# Altium schematic sheet Sheet.SchDoc
size A4
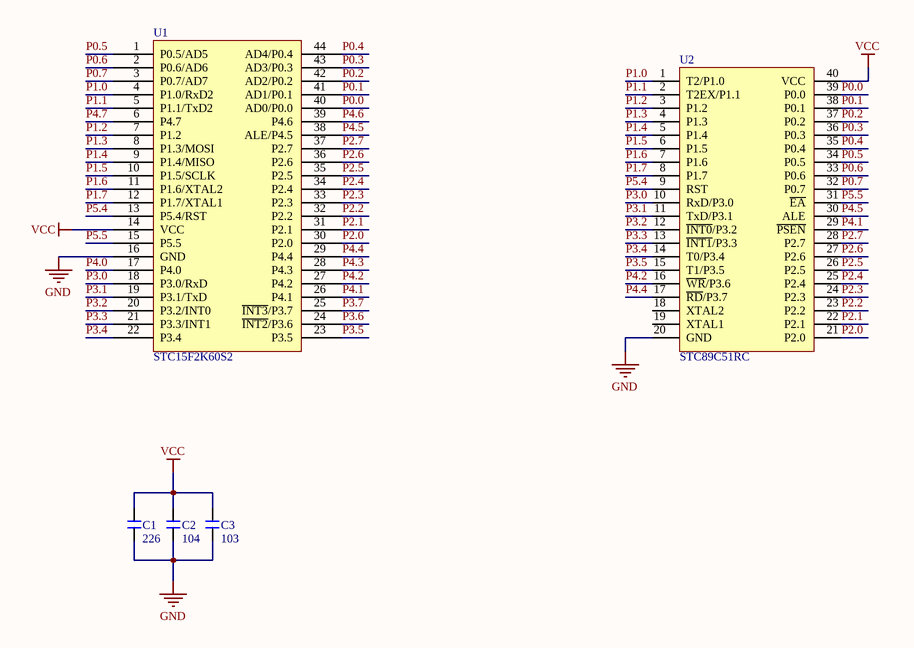
[diagram p0: Sheet.SchDoc]

## Parts
C1  226  [C 1206_M]
C2  104  [C 0805_L]
C3  103  [C 0805_L]
U1  STC15F2K60S2  [LQFP44 10X10_L]
U2  STC89C51RC  [DIP40-600]

## Nets
GND: C1.1 C2.1 C3.1 U1.16(GND) U2.20(GND)
VCC: C1.2 C2.2 C3.2 U1.14(VCC) U2.40(VCC)
P0.0: U1.40(AD0/P0.0) U2.39(P0.0)
P0.1: U1.41(AD1/P0.1) U2.38(P0.1)
P0.2: U1.42(AD2/P0.2) U2.37(P0.2)
P0.3: U1.43(AD3/P0.3) U2.36(P0.3)
P0.4: U1.44(AD4/P0.4) U2.35(P0.4)
P0.5: U1.1(P0.5/AD5) U2.34(P0.5)
P0.6: U1.2(P0.6/AD6) U2.33(P0.6)
P0.7: U1.3(P0.7/AD7) U2.32(P0.7)
P1.0: U1.4(P1.0/RxD2) U2.1(T2/P1.0)
P1.1: U1.5(P1.1/TxD2) U2.2(T2EX/P1.1)
P1.2: U1.7(P1.2) U2.3(P1.2)
P1.3: U1.8(P1.3/MOSI) U2.4(P1.3)
P1.4: U1.9(P1.4/MISO) U2.5(P1.4)
P1.5: U1.10(P1.5/SCLK) U2.6(P1.5)
P1.6: U1.11(P1.6/XTAL2) U2.7(P1.6)
P1.7: U1.12(P1.7/XTAL1) U2.8(P1.7)
P2.0: U1.30(P2.0) U2.21(P2.0)
P2.1: U1.31(P2.1) U2.22(P2.1)
P2.2: U1.32(P2.2) U2.23(P2.2)
P2.3: U1.33(P2.3) U2.24(P2.3)
P2.4: U1.34(P2.4) U2.25(P2.4)
P2.5: U1.35(P2.5) U2.26(P2.5)
P2.6: U1.36(P2.6) U2.27(P2.6)
P2.7: U1.37(P2.7) U2.28(P2.7)
P3.0: U1.18(P3.0/RxD) U2.10(RxD/P3.0)
P3.1: U1.19(P3.1/TxD) U2.11(TxD/P3.1)
P3.2: U1.20(P3.2/INT0) U2.12(~{INT0}/P3.2)
P3.3: U1.21(P3.3/INT1) U2.13(~{INT1}/P3.3)
P3.4: U1.22(P3.4) U2.14(T0/P3.4)
P3.5: U1.23(P3.5) U2.15(T1/P3.5)
P3.6: U1.24(~{INT2}/P3.6)
P3.7: U1.25(~{INT3}/P3.7)
P4.0: U1.17(P4.0)
P4.1: U1.26(P4.1) U2.29(~{PSEN})
P4.2: U1.27(P4.2) U2.16(~{WR}/P3.6)
P4.3: U1.28(P4.3)
P4.4: U1.29(P4.4) U2.17(~{RD}/P3.7)
P4.5: U1.38(ALE/P4.5) U2.30(ALE)
P4.6: U1.39(P4.6)
P4.7: U1.6(P4.7)
P5.4: U1.13(P5.4/RST) U2.9(RST)
P5.5: U1.15(P5.5) U2.31(~{EA})

Not connected (* = marked no-connect by the designer): U2 18(XTAL2) 19(XTAL1)

## Library data of the parts
C1-C3 = C: 无极性贴片电容; 版权归属: 源创客; BOM名称: 无极性贴片电容; 学习资源: www.ooocke.com
U1 = STC15F2K60S2-44pin: STC单片机; 版权归属: 源创客; BOM名称: STC单片机; 学习资源: www.ooocke.com
U2 = STC89C51RC: STC单片机; 版权归属: 源创客; BOM名称: STC单片机; 学习资源: www.ooocke.com